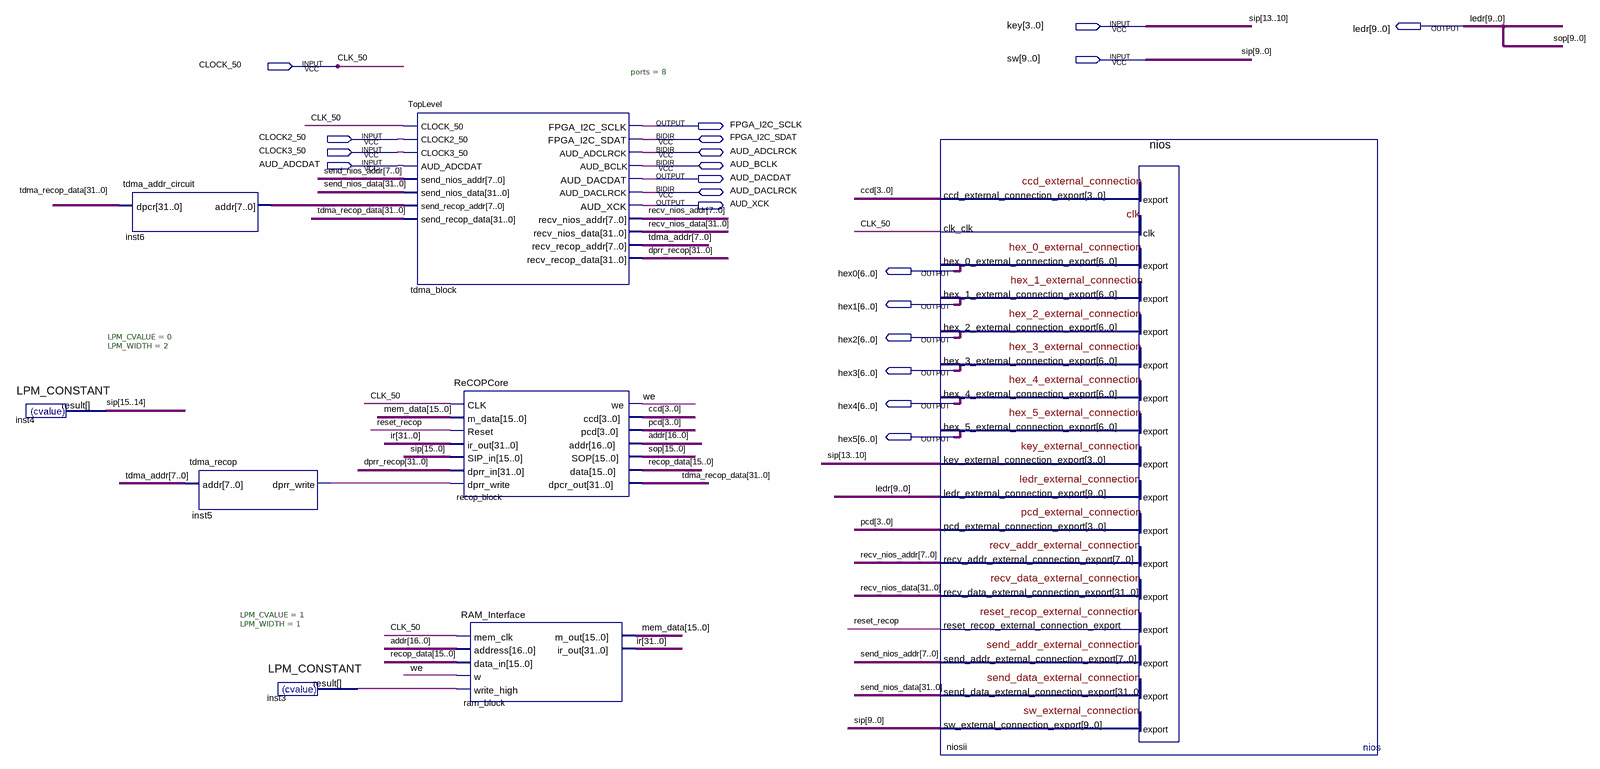
[diagram p0: schematic sheet]
// Quartus schematic toptoplevel.bdf as structural Verilog: 8 symbols, 20 pins
module toptoplevel (
  input  [3:0] key,
  input  [9:0] sw,
  input  CLOCK_50,
  input  CLOCK2_50,
  input  CLOCK3_50,
  input  AUD_ADCDAT,
  inout  FPGA_I2C_SDAT,
  inout  AUD_ADCLRCK,
  inout  AUD_BCLK,
  inout  AUD_DACLRCK,
  output [9:0] ledr,
  output FPGA_I2C_SCLK,
  output AUD_DACDAT,
  output AUD_XCK,
  output [6:0] hex0,
  output [6:0] hex1,
  output [6:0] hex2,
  output [6:0] hex3,
  output [6:0] hex4,
  output [6:0] hex5
);

  wire inst3_result, inst5_dprr_write, reset_recop, we;
  wire [3:0] ccd, pcd;
  wire [7:0] inst6_addr, recv_nios_addr, send_nios_addr, tdma_addr;
  wire [15:0] mem_data, recop_data, sop;
  wire [15:14] sip;
  wire [16:0] addr;
  wire [31:0] dprr_recop, ir, recv_nios_data, send_nios_data, tdma_recop_data;

  LPM_CONSTANT #(.LPM_CVALUE(0), .LPM_WIDTH(2)) inst4 (.result(sip));
  tdma_addr_circuit inst6 (.dpcr(tdma_recop_data), .addr(inst6_addr));
  tdma_recop inst5 (.addr(tdma_addr), .dprr_write(inst5_dprr_write));
  LPM_CONSTANT #(.LPM_CVALUE(1), .LPM_WIDTH(1)) inst3 (.result(inst3_result));
  TopLevel #(.ports(8)) tdma_block (
    .CLOCK_50(CLOCK_50), .CLOCK2_50(CLOCK2_50), .CLOCK3_50(CLOCK3_50), .AUD_ADCDAT(AUD_ADCDAT),
    .send_nios_addr(send_nios_addr), .send_nios_data(send_nios_data), .send_recop_addr(inst6_addr),
    .send_recop_data(tdma_recop_data), .FPGA_I2C_SCLK(FPGA_I2C_SCLK), .AUD_DACDAT(AUD_DACDAT),
    .AUD_XCK(AUD_XCK), .recv_nios_addr(recv_nios_addr), .recv_nios_data(recv_nios_data),
    .recv_recop_addr(tdma_addr), .recv_recop_data(dprr_recop), .FPGA_I2C_SDAT(FPGA_I2C_SDAT),
    .AUD_ADCLRCK(AUD_ADCLRCK), .AUD_BCLK(AUD_BCLK), .AUD_DACLRCK(AUD_DACLRCK));
  ReCOPCore recop_block (
    .CLK(CLOCK_50), .m_data(mem_data), .Reset(reset_recop), .ir_out(ir), .SIP_in({sip, key, sw}),
    .dprr_in(dprr_recop), .dprr_write(inst5_dprr_write), .we(we), .ccd(ccd), .pcd(pcd), .addr(addr),
    .SOP(sop), .data(recop_data), .dpcr_out(tdma_recop_data));
  RAM_Interface ram_block (
    .mem_clk(CLOCK_50), .address(addr), .data_in(recop_data), .w(we), .write_high(inst3_result),
    .m_out(mem_data), .ir_out(ir));
  nios niosii (
    .ccd_external_connection_export(ccd), .clk_clk(CLOCK_50), .key_external_connection_export(key),
    .pcd_external_connection_export(pcd), .recv_addr_external_connection_export(recv_nios_addr),
    .recv_data_external_connection_export(recv_nios_data), .sw_external_connection_export(sw),
    .hex_0_external_connection_export(hex0), .hex_1_external_connection_export(hex1),
    .hex_2_external_connection_export(hex2), .hex_3_external_connection_export(hex3),
    .hex_4_external_connection_export(hex4), .hex_5_external_connection_export(hex5),
    .ledr_external_connection_export(ledr), .reset_recop_external_connection_export(reset_recop),
    .send_addr_external_connection_export(send_nios_addr),
    .send_data_external_connection_export(send_nios_data));

  // Other names for the same wires on the sheet: CLK_50 = CLOCK_50; sip[13:0] = {key, sw}
endmodule
